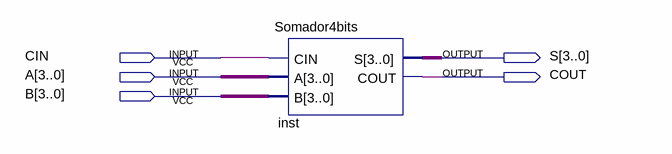
[diagram p0: schematic sheet]
// Quartus schematic SomadorMesmo.bdf as structural Verilog: 1 symbols, 5 pins
module SomadorMesmo (
  input  CIN,
  input  [3:0] A,
  input  [3:0] B,
  output [3:0] S,
  output COUT
);

  Somador4bits inst (.CIN(CIN), .A(A), .B(B), .S(S), .COUT(COUT));
endmodule
